# Altium schematic sheet Infrarouge R&T, LED SMD.SchDoc
size Letter; Organization: Cegep Limoilou; Address1: 1300, 8e Avenue; Address2: Québec, QC; Address3: Canada; Address4: G1J 5L5; Revision: Enseignants; SheetNumber: 6; SheetTotal: 8; Conception: Ilyes Gharmoul; Titre: Infrarouge et LED SMD; Modification: Ilyes G
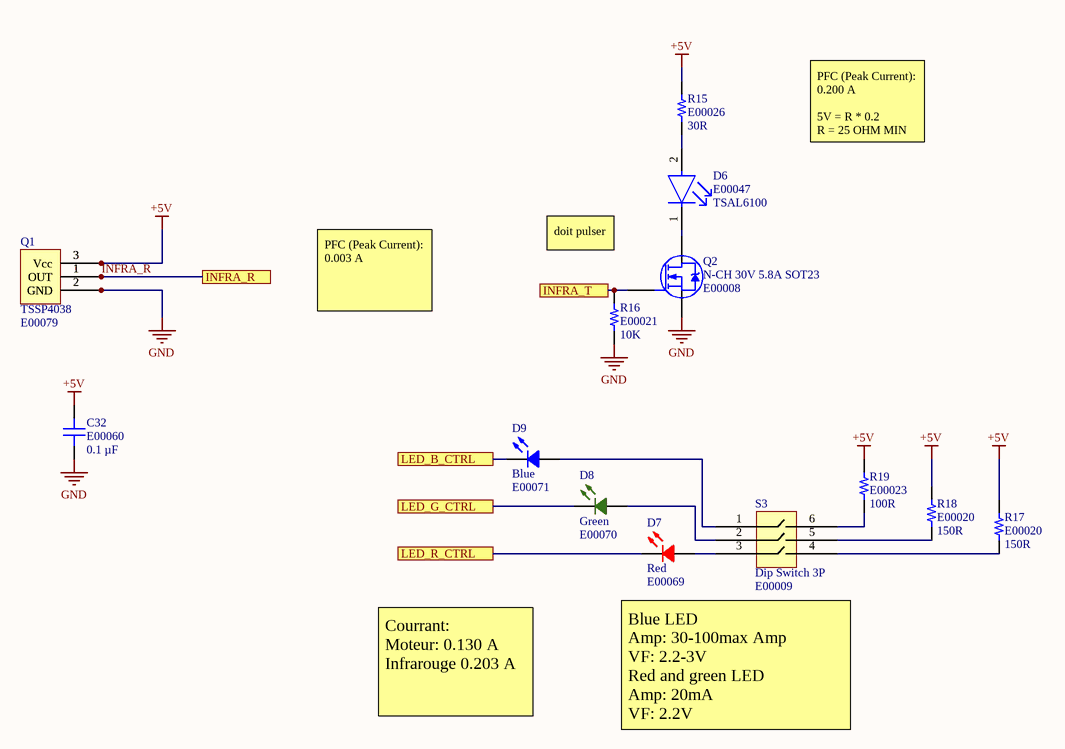
[diagram p0: Infrarouge R&T, LED SMD.SchDoc]

## Parts
C32  ADAM Inventory Number 1: E00060  [CAP 0603]  (hidden comment: 0.1 µF)
D6  ADAM Inventory Number 1: E00047  [IR TRANSMITTER]  (hidden comment: TSAL6100)
D7  Red  ADAM Inventory Number 1: E00069  [Red Led 0603]
D8  Green  ADAM Inventory Number 1: E00070  [Green LED 0603]
D9  Blue  ADAM Inventory Number 1: E00071  [Blue LED 0603]
Q1  TSSP4038  ADAM Inventory Number 1: E00079  [IR Receptor]
Q2  N-CH 30V 5.8A SOT23  ADAM Inventory Number 1: E00008  [N-CHANNEL TRANS]
R15  ADAM Inventory Number 1: E00026  [RES 0603]  (hidden comment: 30R)
R16  ADAM Inventory Number 1: E00021  [RES 0603]  (hidden comment: 10K)
R17  ADAM Inventory Number 1: E00020  [RES 0603]  (hidden comment: 150R)
R18  ADAM Inventory Number 1: E00020  [RES 0603]  (hidden comment: 150R)
R19  ADAM Inventory Number 1: E00023  [RES 0603]  (hidden comment: 100R)
S3  Dip Switch 3P  ADAM Inventory Number 1: E00009  [DIPSWITCH SMD 3P]

## Ports
INFRA_R, INFRA_T, LED_B_CTRL, LED_G_CTRL, LED_R_CTRL

## Nets
+5V: C32.2 Q1.3(Vcc) R15.2 R17.2 R18.2 R19.2
GND: C32.1 Q1.2(GND) Q2.2(S) R16.1
INFRA_R: Q1.1(OUT) ; port INFRA_R
INFRA_T: Q2.1(G) R16.2 ; port INFRA_T
LED_B_CTRL: D9.2 ; port LED_B_CTRL
LED_G_CTRL: D8.2 ; port LED_G_CTRL
LED_R_CTRL: D7.2 ; port LED_R_CTRL
NetD6_1: D6.1(C) Q2.3(D)
NetD6_2: D6.2(A) R15.1
NetD7_1: D7.1 S3.3
NetD8_1: D8.1 S3.2
NetD9_1: D9.1 S3.1
NetR17_1: R17.1 S3.4
NetR18_1: R18.1 S3.5
NetR19_1: R19.1 S3.6

## Notes on the sheet
- PFC (Peak Current): 0.200 A
  5V = R * 0.2
  R = 25 OHM MIN
- doit pulser
- PFC (Peak Current): 0.003 A
- Courrant:
  Moteur: 0.130 A
  Infrarouge 0.203 A
- Blue LED
  Amp: 30-100max Amp
  VF: 2.2-3V
  Red and green LED
  Amp: 20mA
  VF: 2.2V
- Titre :
- Conception :
- Date :
- Modification :
- Heure :
- Révision :
- Feuille
- de
- Fichier :

## Library data of the parts
C32 = CAP CER 0.1UF 50V X7R 0603: Manufacturer Part Number 1: C0603C104K5RAC7411; manufacturer: KEMET; Tolerance: ±10%; Applications: Bypass, Decoupling; Capacitance: 0.1 µF; componentlink1description: Datasheet; componentlink1url: https://api.kemet.com/component-edge/download/datasheet/C0603C104K5RAC7411.pdf; componentlink2description: DigiKey Link; componentlink2url: https://www.digikey.com/en/products/detail/kemet/C0603C104K5RAC7411/3317013; Device Package: 0603 (1608 Metric); lastupdated: 2023-03-28 19:09:05; Lifecycle Status: Active; Minimum Order: 1; Mounting Type: Surface Mount, MLCC; Operating Temperature: -55°C ~ 125°C; Package / Case: 0603 (1608 Metric); packaging: TapeAndReel; partid: 2233; Part Status: Active; price: 0.01; series: SMD Comm X7R; Size / Dimension: 0.063" L x 0.031" W (1.60mm x 0.80mm); Supplier 1: DigiKey; Supplier Part Number 1: 399-C0603C104K5RAC7411CT-ND; Temperature Coefficient: X7R; Thickness (Max): 0.035" (0.90mm); Voltage - Rated: 50V; Value: 0.1 µF
D6 = TSAL6100: Infrared (IR) Emitter 940nm 1.35V 100mA 80mW/sr @ 100mA 20° Radial, 5mm Dia (T 1 3/4); Manufacturer Part Number 1: TSAL6100
D7 = 0603 RED LED: Manufacturer Part Number 1: BL-HUB36A-AV-TRB; Manufacturer: American Bright Optoelectronics Corporation; Configuration: Standard; Current - Test: 20mA; Lens Color: Colorless; Lens Style: Rectangle with Flat Top; Lens Transparency: Clear; Millicandela Rating: 94mcd; Viewing Angle: 120°; Voltage - Forward (Vf) (Typ): 2.2V; Wavelength - Dominant: 632nm; Wavelength - Peak: 645nm; Color: Red; ComponentLink1Description: Datasheet; ComponentLink1URL: https://americanbrightled.com/pdffiles/smt/BL-HUB36A-AV-TRB.pdf; ComponentLink2Description: DigiKey Link; ComponentLink2URL: https://www.digikey.com/en/products/detail/american-bright-optoelectronics-corporation/BL-HUB36A-AV-TRB/9678174; Device Package: 0603 (1608 Metric); Height (Max): 0.70mm; LastUpdated: 2023-03-27 19:53:19; Lifecycle Status: Active; Minimum Order: 1; Mounting Type: Surface Mount; Package / Case: 0603 (1608 Metric); Packaging: TapeAndReel; PartId: 1020; Part Status: Active; Price: 0.04; Series: -; Size / Dimension: 1.60mm L x 0.80mm W; Supplier 1: DigiKey; Supplier Part Number 1: BL-HUB36A-AV-TRBCT-ND; Supplier Device Package: 0603; Value: Red
D8 = 0603 GREEN LED: LED GREEN 0603 SMD; Manufacturer Part Number 1: 5973316507F; Manufacturer: Dialight; Configuration: Standard; Current - Test: 20mA; Lens Color: 1.24mm; Lens Style: Round with Domed Top; Millicandela Rating: 34mcd; Voltage - Forward (Vf) (Typ): 2V; Wavelength - Dominant: 560nm; Color: Green; ComponentLink1Description: Datasheet; ComponentLink1URL: http://www.dialightsignalsandcomponents.com/Assets/Drawings/2D_Drawings_DrawingDetailedSpec/NewDrawings/C18371C.pdf; ComponentLink2Description: DigiKey Link; ComponentLink2URL: https://www.digikey.com/en/products/detail/dialight/5973316507F/9385428; Device Package: 0603 (1608 Metric); Height (Max): 1.24mm; LastUpdated: 2023-03-27 19:52:49; Lifecycle Status: Active; Minimum Order: 1; Mounting Type: Surface Mount; Package / Case: 0603 (1608 Metric); Packaging: TapeAndReel; PartId: 587; Part Status: Active; Price: 0.13; Series: 597; Size / Dimension: 1.60mm L x 0.80mm W; Supplier 1: DigiKey; Supplier Part Number 1: 350-4373-1-ND; Supplier Device Package: 0603; Value: Green
D9 = 0603 BLUE LED: Blue 470nm LED Indication - Discrete 3.3V 0603 (1608 Metric); Manufacturer Part Number 1: APT1608LVBC/D; Supplier 1: Digi-Key; Supplier Part Number 1: 754-1933-1-ND
Q1 = TSSP4038IR Sensor: Remote Receiver Sensor 38.0kHz 45m Through Hole; Manufacturer Part Number 1: TSSP4038; Supplier 1: Digi-Key; Supplier Part Number 1: TSSP4038-ND
Q2 = TRANS N-CHANNEL 30V 5.8A SOT23: N-Channel 5.8A (Tj) 350mW Surface Mount SOT-23; Manufacturer: MCC; Manufacturer Part Number 1: SI3404-TP; Source: IC_Component.SchLib; Design Item ID: TRANS N-CHANNEL 30V 5.8A SOT23; Component Type: Transistors; Supplier 1: Digi-Key; Supplier Part Number 1: DMN3051LDICT-ND
R15 = RES SMD 30 OHM: RES 30 OHM 1% 1/3W 0603; Manufacturer Part Number 1: SG73P1JTTD30R0F; Manufacturer: KOA Speer Electronics, Inc.; Power (Watts): 0.333W, 1/3W; Temperature Coefficient: ±200ppm/°C; ComponentLink1Description: Datasheet; ComponentLink1URL: https://www.koaspeer.com/pdfs/SG73P.pdf; ComponentLink2Description: DigiKey Link; ComponentLink2URL: https://www.digikey.com/en/products/detail/koa-speer-electronics-inc/SG73P1JTTD30R0F/10188343; Composition: Thick Film; Device Package: 0603 (1608 Metric); Features: Automotive AEC-Q200, Pulse Withstanding; Height - Seated (Max): 0.022" (0.55mm); LastUpdated: 2023-04-03 19:29:12; Lifecycle Status: Active; Minimum Order: 1; Number of Terminations: 2; Operating Temperature: -55°C ~ 155°C; Package / Case: 0603 (1608 Metric); Packaging: TapeAndReel; PartId: 62768; Part Status: Active; Price: 0.01; Ratings: AEC-Q200; Resistance: 30R; Series: SG73P; Size / Dimension: 0.063" L x 0.031" W (1.60mm x 0.80mm); Supplier 1: DigiKey; Supplier Part Number 1: 2019-SG73P1JTTD30R0FCT-ND; Supplier Device Package: 0603; Tolerance: ±1%; Value: 30R
R16 = RES SMD 10K OHM: RES SMD 10K OHM 1% 1/10W 0603; Manufacturer Part Number 1: RC0603FR-0710KL; Manufacturer: Rohm Semiconductor; Power (Watts): 0.25W, 1/4W; Temperature Coefficient: ±100ppm/°C; ComponentLink1Description: Datasheet; ComponentLink1URL: https://www.rohm.com/datasheet/ESR01MZPF/esr-e; ComponentLink2Description: DigiKey Link; ComponentLink2URL: https://www.digikey.com/en/products/detail/rohm-semiconductor/ESR03EZPF1002/1983429; Composition: Thick Film; Device Package: 0603 (1608 Metric); Features: Automotive AEC-Q200, Pulse Withstanding; Height - Seated (Max): 0.022" (0.55mm); LastUpdated: 2023-03-27 19:26:49; Lifecycle Status: Active; Minimum Order: 1; Number of Terminations: 2; Operating Temperature: -55°C ~ 155°C; Package / Case: 0603 (1608 Metric); Packaging: TapeAndReel; PartId: 5466; Part Status: Active; Price: 0.02; Ratings: AEC-Q200; Resistance: 10K; Series: ESR; Size / Dimension: 0.063" L x 0.031" W (1.60mm x 0.80mm); Supplier Device Package: 0603; Tolerance: ±1%; Supplier 1: Future Electronics; Supplier Part Number 1: 3349388; Value: 10K
R17 R18 = RES SMD 150 OHM: RES SMD 150 OHM 0.1% 1/8W 0603; Manufacturer Part Number 1: RC0603FR-07150RL; Manufacturer: Vishay Beyschlag; Power (Watts): 0.125W, 1/8W; Temperature Coefficient: ±25ppm/°C; ComponentLink1Description: Datasheet; ComponentLink1URL: http://www.vishay.com/docs/28785/mcat_pre.pdf; ComponentLink2Description: DigiKey Link; ComponentLink2URL: http://digikey.com/product-detail/en/vishay-beyschlag/MCT0603MD1500BP100/MCT0603-150-MBCT-ND/2092134; Composition: Thin Film; Device Package: 0603 (1608 Metric); Features: Anti-Sulfur, Automotive AEC-Q200; Height - Seated (Max): 0.022" (0.55mm); LastUpdated: 2023-04-04 19:29:46; Lifecycle Status: Active; Minimum Order: 1; Number of Terminations: 2; Operating Temperature: -55°C ~ 155°C; Package / Case: 0603 (1608 Metric); Packaging: TapeAndReel; PartId: 5246; Part Status: Active; Price: 0.23; Ratings: AEC-Q200; Resistance: 150R; Series: MCT AT - Precision; Size / Dimension: 0.061" L x 0.033" W (1.55mm x 0.85mm); Supplier Device Package: 0603; Tolerance: ±0.1%; Supplier 1: Future Electronics; Supplier Part Number 1: 1201284; Value: 150R
R19 = RES SMD 100 OHM: RESISTOR 100 Ohm SMD 1% 1/10W; Manufacturer Part Number 1: AC0603FR-10100RL; Manufacturer: Yageo; Power (Watts): 0.1W, 1/10W; Temperature Coefficient: ±100ppm/°C; ComponentLink1Description: Datasheet; ComponentLink1URL: https://www.yageo.com/upload/media/product/productsearch/datasheet/rchip/PYu-AC_51_RoHS_L_8.pdf; ComponentLink2Description: DigiKey Link; ComponentLink2URL: https://www.digikey.com/en/products/detail/yageo/AC0603FR-10100RL/14286596; Composition: Thick Film; Device Package: 0603 (1608 Metric); Features: Automotive AEC-Q200; Height - Seated (Max): 0.022" (0.55mm); LastUpdated: 2023-04-09 19:28:34; Lifecycle Status: Active; Minimum Order: 1; Number of Terminations: 2; Operating Temperature: -55°C ~ 155°C; Package / Case: 0603 (1608 Metric); Packaging: CutTape; PartId: 64201; Part Status: Active; Price: 0.01; Ratings: AEC-Q200; Resistance: 100R; Series: AC; Size / Dimension: 0.063" L x 0.031" W (1.60mm x 0.80mm); Supplier 1: DigiKey; Supplier Part Number 1: 13-AC0603FR-10100RLCT-ND; Supplier Device Package: 0603; Tolerance: ±1%; Value: 100R
S3 = Dip Switch 3P: Dip Switch SPST 3 Position Surface Mount Slide (Standard) Actuator 25mA 24VDC; Manufacturer Part Number 1: DS04-254-2-03BK-SMT; Manufacturer: CUI; Source: IC_Component.SchLib; Design Item ID: Switch SLIDE SPDT 3 pos; Component Type: Switches; Supplier 1: Mouser; Supplier Part Number 1: 653-A6S-3102-H